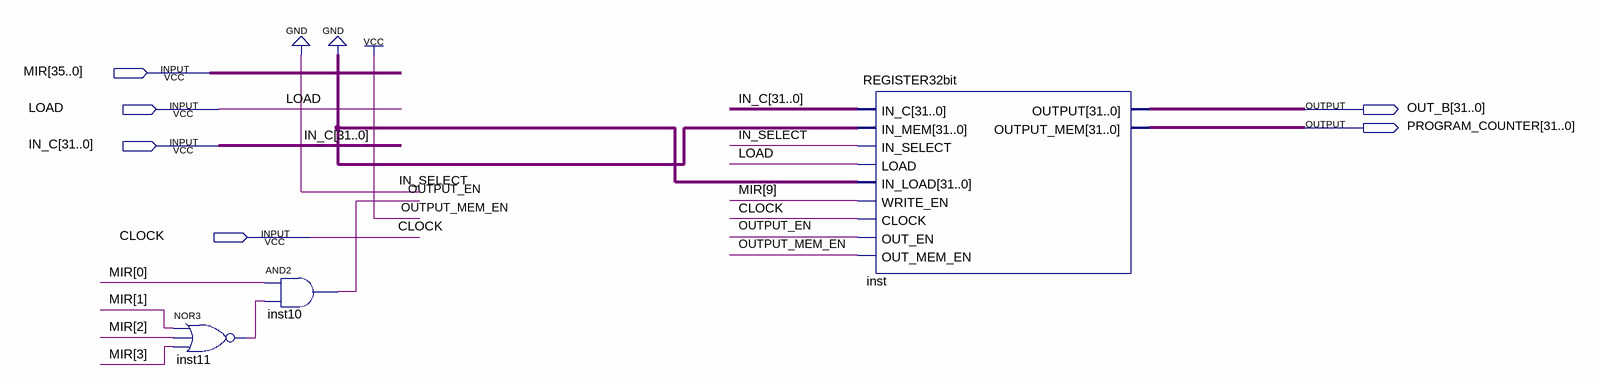
[diagram p0: schematic sheet]
// Quartus schematic PC.bdf as structural Verilog: 3 symbols, 6 pins
module PC (
  input  [35:0] MIR,
  input  LOAD,
  input  [31:0] IN_C,
  input  CLOCK,
  output [31:0] OUT_B,
  output [31:0] PROGRAM_COUNTER
);

  wire inst11_out, OUTPUT_EN;

  nor inst11 (inst11_out, MIR[1], MIR[2], MIR[3]);
  and inst10 (OUTPUT_EN, MIR[0], inst11_out);
  REGISTER32bit inst (
    .IN_C(IN_C), .IN_MEM({32{1'b0}}), .IN_SELECT(1'b0), .LOAD(LOAD), .IN_LOAD({32{1'b0}}), .WRITE_EN(MIR[9]),
    .CLOCK(CLOCK), .OUT_EN(OUTPUT_EN), .OUT_MEM_EN(1'b1), .OUTPUT(OUT_B), .OUTPUT_MEM(PROGRAM_COUNTER));
endmodule
